# EAGLE design shrew-mega (EAGLE 7.6.0)
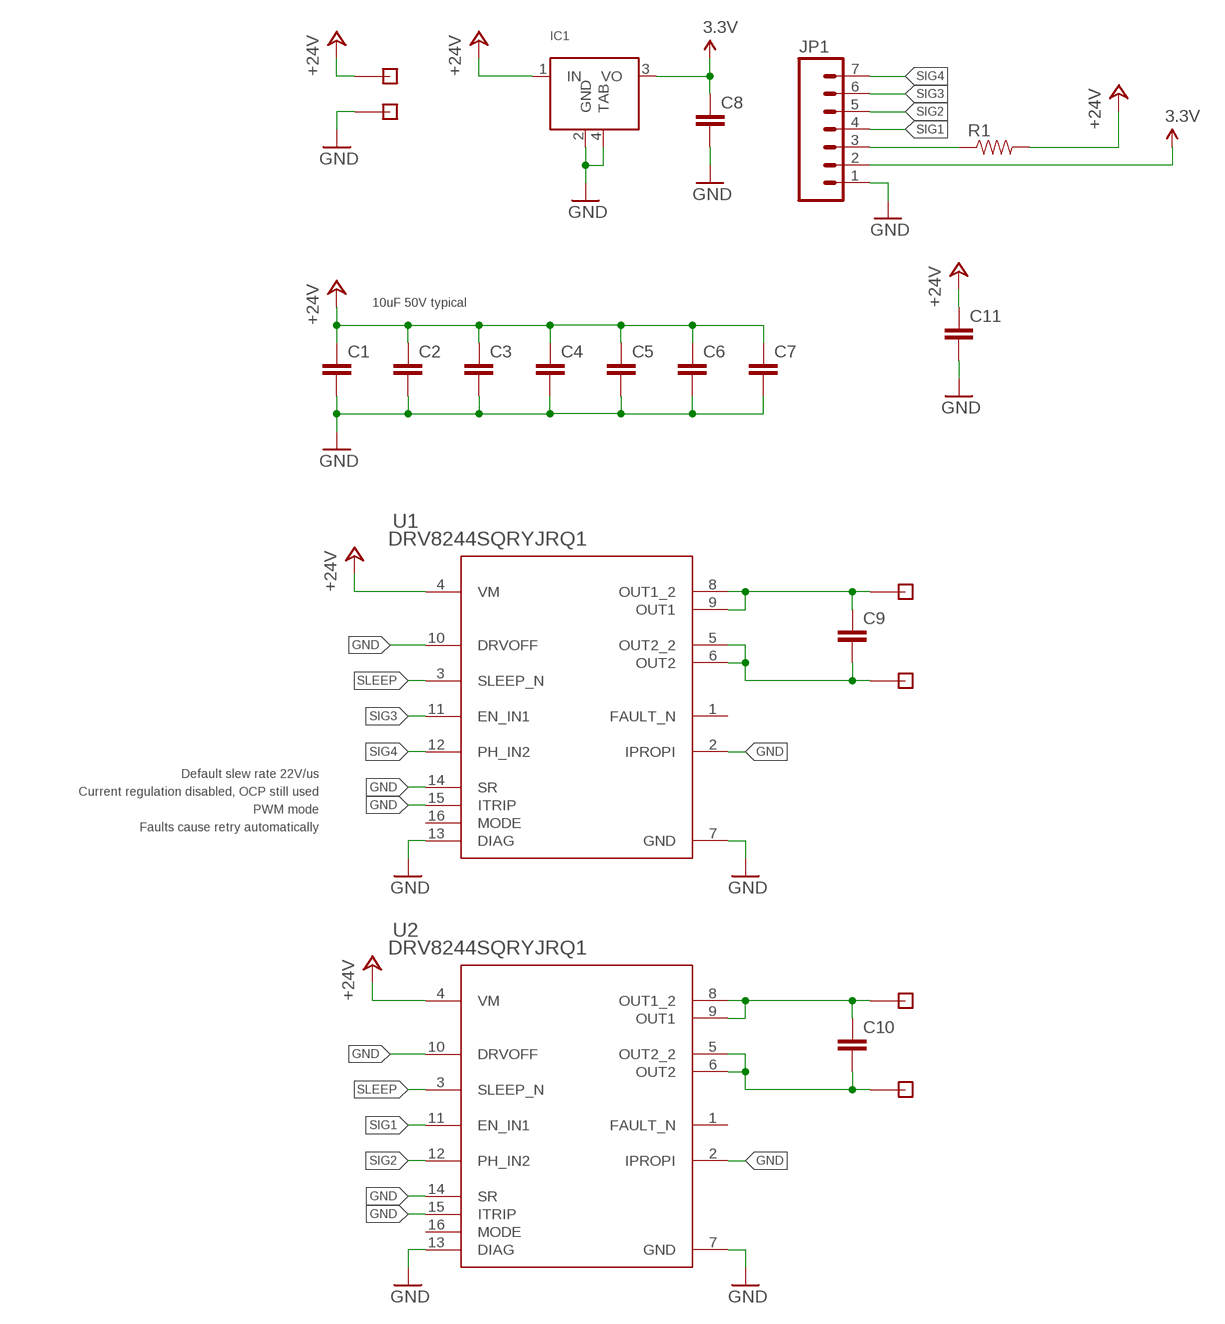
[diagram p0: schematic, sheet 1]

## Parts
C1  CAP0805  [0805]
C2  CAP0805  [0805]
C3  CAP0805  [0805]
C4  CAP0805  [0805]
C5  CAP0805  [0805]
C6  CAP0805  [0805]
C7  CAP0805  [0805]
C8  CAP0805  [0805]
C9  CAP0402-CAP  [0402-CAP]
C10  CAP0402-CAP  [0402-CAP]
C11  CAP0805  [0805]
IC1  V_REG_SOT-SOT223  [SOT223]
JP1  M07-2MM-TH  [1X07-2MM-TH]
R1  RESISTOR0402-RES  [0402-RES]
U1  DRV8244SQRYJRQ1  [RYJ0016A-MFG]
U2  DRV8244SQRYJRQ1  [RYJ0016A-MFG]
X1  PIN-1X-BIG  [PAD-1X-BIG]
X2  PIN-1X-BIG  [PAD-1X-BIG]
X3  PIN-1X-BIG  [PAD-1X-BIG]
X4  PIN-1X-BIG  [PAD-1X-BIG]
X5  PIN-1X-BIG  [PAD-1X-BIG]
X6  PIN-1X-BIG  [PAD-1X-BIG]

## Nets
3.3V: C8.1 IC1.3(VO) JP1.2
+24V: C1.1 C2.1 C3.1 C4.1 C5.1 C6.1 C7.1 C11.1 IC1.1(IN) R1.2 U1.4(VM) U2.4(VM) X5.1
GND: C1.2 C2.2 C3.2 C4.2 C5.2 C6.2 C7.2 C8.2 C11.2 IC1.2(GND) IC1.4(TAB) JP1.1 U1.2(IPROPI) U1.7(GND) U1.10(DRVOFF) U1.13(DIAG) U1.14(SR) U1.15(ITRIP) U2.2(IPROPI) U2.7(GND) U2.10(DRVOFF) U2.13(DIAG) U2.14(SR) U2.15(ITRIP) X6.1
MOTOR1: C9.1 U1.8(OUT1_2) U1.9(OUT1) X2.1
MOTOR2: C9.2 U1.5(OUT2_2) U1.6(OUT2) X1.1
MOTOR3: C10.1 U2.8(OUT1_2) U2.9(OUT1) X4.1
MOTOR4: C10.2 U2.5(OUT2_2) U2.6(OUT2) X3.1
SIG1: JP1.4 U2.11(EN_IN1)
SIG2: JP1.5 U2.12(PH_IN2)
SIG3: JP1.6 U1.11(EN_IN1)
SIG4: JP1.7 U1.12(PH_IN2)
SLEEP: U1.3(SLEEP_N) U2.3(SLEEP_N)
V-ADC: JP1.3 R1.1
Unconnected: U1.1(FAULT_N) U1.16(MODE) U2.1(FAULT_N) U2.16(MODE)

## Notes on the sheet
- 10uF 50V typical
- Default slew rate 22V/us
- Current regulation disabled, OCP still used
- PWM mode
- Faults cause retry automatically

## Library data of the parts
C1-C11 = shrew-common:CAP: Capacitor Standard 0603 ceramic capacitor, and 0.1" leaded capacitor.
IC1 = shrew-common:V_REG_SOT
JP1 = shrew-common:M07: Header 7 Standard 7-pin 0.1" header. Use with straight break away headers (SKU : PRT-00116), right angle break away headers (PRT-00553), swiss pins (PRT-00743), machine pins (PRT-00117), and female headers (PRT-00115). NOTES ON THE VARIANTS LOCK and LOCK_LONGPADS... This footprint was designed to help hold the alignment of a through-hole component (i.e. 7-pin header) while soldering it into place. You may notice that each hole has been shifted either up or down by 0.005 of an inch from it's more standard position (which is usually a perfectly straight line). This slight alteration caused the pins (the squares in the middle) to touch the edges of the holes. Because they are alternating, it causes a "brace" to hold the header in place. 0.005 has proven to be the perfect amount of "off-center" position when using our standard breakaway headers. Although looks a little odd when you look at the bare footprint, once you have a header in there, the alteration is very hard to notice. Also, if you push a header all the way into place, it is covered up entirely on the bottom side. This idea of altering the position of holes to aid alignment will be further integrated into the Sparkfun Library for other footprints. It can help hold any component with 3 or more connection pins.
R1 = shrew-common:RESISTOR: Resistor Basic schematic elements and footprints for 0603, 1206, and PTH resistors.
U1 U2 = shrew-core:DRV8244SQRYJRQ1; COPYRIGHT: Copyright (C) 2024 Ultra Librarian. All rights reserved.; MANUFACTURER_PART_NUMBER: DRV8244SQRYJRQ1; MFR_NAME: Texas Instruments; REFDES: RefDes; TYPE: TYPE
X1-X6 = shrew-core:PIN-1X

## Board
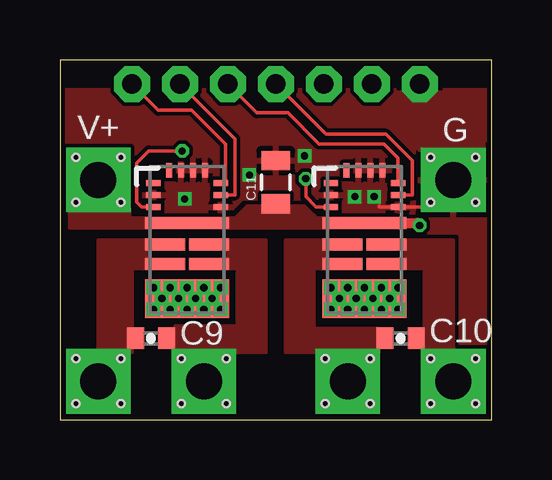
[diagram p1: board, top side]
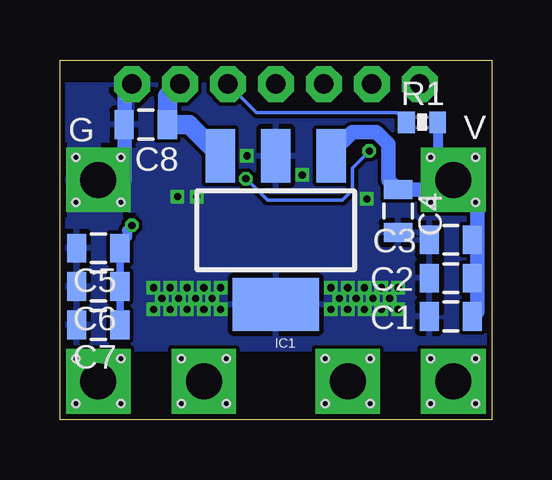
[diagram p2: board, bottom side, seen from below]

Size 18 x 15 mm. Coordinates in mm from the lower left corner, seen from the top.
Outline: 0,0 18,0 18,15 0,15 0,0
Copper layers (1*16): Top 0.035mm / dielectric 1.6mm / Bottom 0.035mm
Design rules "jlcpcb-2layers *": minimum track width 5mil, minimum drill 0.3mm, track to track 5mil, track to pad 5mil, pad to pad 5mil, via to via 5mil, smd to smd 5mil, copper to edge 0.2mm, drill to drill 6mil, minimum pad ring 10mil, minimum via ring 0.13mm, stop-mask expansion 4mil, vias tented up to drill 20mil, thermal gap 8mil
tRestrict: 1 lines
bRestrict: 3 lines

### Footprints (pad centres in the part's own frame; a part is rotated, then mirrored left to right if it is on the bottom)
0805 = smd 0.8 x 1.2: 1 -0.9,0; 2 0.9,0
0402-CAP = smd 0.7 x 0.9: 1 -0.65,0; 2 0.65,0
SOT223 = smd 1.219 x 2.235: 1 -2.311,-3.099; 2 0,-3.099; 3 2.311,-3.099 | smd 3.6 x 2.2: 4 0,3.099
1X07-2MM-TH = drill 0.8 pad 1.5 octagon: 1 -6,0; 2 -4,0; 3 -2,0; 4 0,0; 5 2,0; 6 4,0; 7 6,0
0402-RES = smd 0.7 x 0.9: 1 -0.65,0; 2 0.65,0
RYJ0016A-MFG = smd 0.6 x 0.25: 1 -1.4,2.375; 2 -1.4,1.875; 3 -1.4,1.375; 10 1.4,1.375; 11 1.4,1.875; 12 1.4,2.375 | smd 3.5 x 0.5: 4 0,0.7 | smd 1.675 x 0.5: 5 -0.913,-0.2; 6 -0.913,-1; 8 0.913,-1; 9 0.913,-0.2 | smd 3.5 x 1.6: 7 0,-2.45 | smd 0.25 x 0.6: 13 0.75,2.9; 14 0.25,2.9; 15 -0.25,2.9; 16 -0.75,2.9
PAD-1X-BIG = drill 1.5 pad 2.5 square: 1 0,0 | hole 0.3: -0.94,0.94; 0.94,0.94; -0.94,-0.94; 0.94,-0.94

### Placement (x,y rotation side)
C1  1.7,4.3 180 bottom
C2  1.7,5.9 180 bottom
C3  1.7,7.5 180 bottom
C4  3.9,8.7 270 bottom
C5  16.4,7.15 180 bottom
C6  16.4,5.55 180 bottom
C7  16.4,3.95 180 bottom
C8  14.42,12.3 180 bottom
C9  3.8,3.39 180 top
C10  14.2,3.39 180 top
C11  9,9.9 90 top
IC1  9,7.9 180 bottom
JP1  9,14 180 top
R1  2.9,12.4 0 bottom
U1  5.3,7.5 0 top
U2  12.7,7.5 0 top
X1  1.6,1.6 0 top
X2  6,1.6 0 top
X3  12,1.6 0 top
X4  16.4,1.6 0 top
X5  1.6,10 0 top
X6  16.4,10 0 top

### Tracks (layer width: path | path; a pad name or v marks a point on that pad's centre or on a via)
3.3V
  Bottom 0.813: IC1.3 12.61,12.3 C8.1 13.52,13.48 JP1.2
+24V  (via drill 0.3)
  Top 0.406: U2.4 14.9,8.2 v15,8.1
  Bottom 0.305: 15.2,7.6 15.5,7.3 C5.1 C6.1 C7.1 | C1.1 0.6,4.7 0.6,4.5 | C2.1 0.6,6.2 0.6,5.8 | C3.1 0.6,7.7 0.6,8
  Bottom 0.406: v15,8.1 15.2,7.9 15.2,7.6 | R1.2 2.25,10.65 X5.1
  Bottom 0.6: 0.6,4.5 0.6,5.8 0.6,8 0.6,9 X5.1 2,9.6 C4.1 4.3,10 4.3,11.5 4.8,12 5.8,12 6.69,11.11 IC1.1
  pour Top (isolate 0.152, no thermals): 3.7,8 0.4,8 0.4,8.8 2.9,8.8 2.9,8.4 3.7,8.4
  pour Top (isolate 0.152, no thermals): 7,8.4 7.3,8.4 7.8,8.9 10.2,8.9 10.7,8.4 11,8.4 11,8 7,8
GND  (via drill 0.3)
  Top 0.152: 13.33,8.91 13.33,8.87 15.22,8.87
  Bottom 0.6: JP1.1 15.3,13.7 15.3,10 X6.1
  other vias: 3.9,5.5 3.9,4.6 5.3,4.6 5.3,5.5 4.6,4.6 4.6,5.5 12.7,4.6 12.7,5.5 14.1,5.5 14.1,4.6 13.4,5.5 13.4,4.6 13.05,5.05 13.75,5.05 4.25,5.05 4.95,5.05 5.2,9.2 12.3,9.3 13.1,9.3 5.65,5.05 6,5.5 6,4.6 6.35,5.05 6.7,5.5 6.7,4.6 12.35,5.05 12,4.6 12,5.5 11.65,5.05 11.3,5.5 11.3,4.6 7.9,10.2 10.2,11
  pour Top (isolate 0.152, rank 5): 0,2.9 0,14 18,14 18,2.9
  pour Bottom (isolate 0.152, rank 5): 0,2.9 0,14 18,14 18,2.9
  pour Bottom (isolate 0.254, no thermals): 14.8,11.2 16.4,11.2 16.4,11.8 17.6,11.8 17.6,8.3 14.8,8.3
  pour Top (isolate 0.254, no thermals): 15,13.9 14.2,13.9 14,13.7 14,12.3 15.2,11.1 17.7,11.1 17.7,13.9
MOTOR1
  pour Top (isolate 0.152, no thermals): 7,7.5 8.6,7.5 8.6,2.8 4.8,2.8 4.8,3.9 7.4,3.9 7.4,6.3 7,6.3
MOTOR2
  pour Top (isolate 0.152, no thermals): 3.6,7.5 1.6,7.5 1.6,2.8 3,2.8 3,6.3 3.6,6.3
MOTOR3
  pour Top (isolate 0.152, no thermals): 14.4,7.48 16.4,7.48 16.4,2.8 15.2,2.8 15.2,6.3 14.4,6.3
MOTOR4
  pour Top (isolate 0.152, no thermals): 11,7.5 9.4,7.5 9.4,2.8 13.3,2.8 13.3,3.8 10.6,3.8 10.6,6.3 11,6.3
SIG1
  Top 0.152: U2.11 14.7,9.38 14.7,10.8 13.6,11.9 11.1,11.9 JP1.4
SIG2
  Top 0.152: U2.12 14.1,10.9 13.5,11.5 10.8,11.5 9.5,12.8 8.2,12.8 JP1.5
SIG3
  Top 0.152: U1.11 7.3,9.38 7.3,11.7 JP1.6
SIG4
  Top 0.152: U1.12 6.9,9.88 6.9,11.49 5.49,12.9 4.1,12.9 JP1.7
SLEEP  (via drill 0.3)
  Top 0.152: v10.25,10.05 10.25,9.3 10.68,8.88 U2.3 | U1.3 3.4,8.88 3.2,9.08 3.2,10.7 3.7,11.2 v5.1,11.2
  Bottom 0.152: v5.1,11.2 5.8,10.5 5.8,9.58 6.23,9.15 9.35,9.15 v10.25,10.05
V-ADC
  Bottom 0.152: JP1.3 9.8,12.8 3.95,12.8 R1.1

### Text on the board
tPlace: V+ | G
bPlace: V | G